# Altium schematic sheet DCP_DC_DC.SchDoc
size 209 x 297 mm; Address1: Address1; Address2: Address2; Address3: Address3; Address4: Address4; SheetNumber: 1; Scale: 1:1; Разраб.: Иванов; Обозначение документа: АБВГ.123456.001 Э3; Пров.: Петров; Утв.: Сидоров; Наименование организации: ОАО "Концерн "МПО-Гидроприбор"; Перв. применение: АБВГ.123456.000; Наименование изделия 1: Плата; Наименование изделия 2: Схема электрическая; Наименование изделия 3: принципиальная; Нач. отд.: Нач. отд.; Фамилия нач. отд.: Сидоров
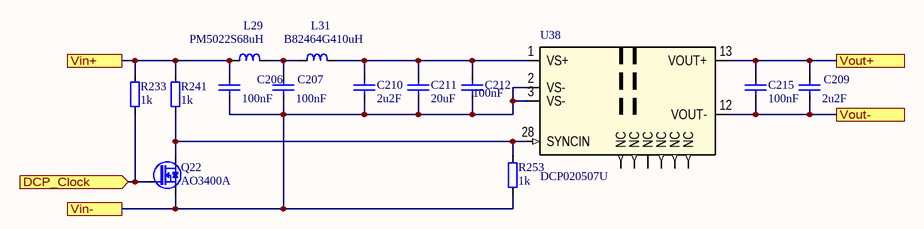
[diagram p0: DCP_DC_DC.SchDoc]

## Parts
C206  100nF  [SMD0805CAP]
C207  100nF  [SMD0805CAP]
C209  2u2F  [SMD0805CAP]
C210  2u2F  [SMD0805CAP]
C211  20uF  [CAPC1206]
C212  100nF  [SMD0805CAP]
C215  100nF  [SMD0805CAP]
L29  PM5022S68uH  [IND_Bourns_PM5022S]
L31  B82464G410uH  [IND_COILCRAFT_MSS1038]
Q22  AO3400A  [SOT95P229X119-3N]
R233  1k  [SMD0805RES]
R241  1k  [SMD0805RES]
R253  1k  [SMD0805RES]
U38  DCP020507U  [SOIC127P1033X265-12_28N]

## Ports
DCP_Clock (in), Vin+, Vin-, Vout+, Vout-

## Nets
DCP_Clock: Q22.1(G) R233.2 ; port DCP_Clock
Vin+: C206.2 L29.1 R233.1 R241.1 ; port Vin+
Vin-: C206.1 C207.1 C210.1 C211.1 C212.1 Q22.2(S) R253.2 U38.2(VS-) U38.3(VS-) ; port Vin-
Vout+: C209.2 C215.2 U38.13(VOUT+) ; port Vout+
Vout-: C209.1 C215.1 U38.12(VOUT-) ; port Vout-
NetC207_2: C207.2 L29.2 L31.1
NetC210_2: C210.2 C211.2 C212.2 L31.2 U38.1(VS+)
NetQ22_3: Q22.3(D) R241.2 R253.1 U38.28(SYNCIN)

Not connected (* = marked no-connect by the designer): U38 14(NC) 15(NC) 16(NC) 17(NC) 26(NC) 27(NC)

## Notes on the sheet
- Перв. примен.
- Справ. №
- Подп. и дата
- Инв. № дубл.
- Взам. инв. №
- Инв. № подл.
- Изм.
- Лист
- № докум.
- Подп.
- Дата
- Копировал
- Формат А4

## Library data of the parts
C206 C207 C209 C210 C212 C215 = C0805: Чип конденсатор 0805; Voltage: 25V; Vendor: Vishay; DielectricType: X5R; SMD Solders: 2; Solder Option: RM; Tolerance: 20%; Pkg: SMD0805; Device: Cap0805; Price: 2
  C206 C207 C212 C215: Value: 100nF
  C209 C210: Value: 2u2F
C211 = C1206: Чип конденсатор 0805; Voltage: 16V; Vendor: Vishay; DielectricType: X5R; SMD Solders: 2; Solder Option: RM; Tolerance: 1%; Pkg: SMD1206; Device: Cap1206; Value: 20uF; Price: 2
L29 = IND_BOURNS_PM5022S: SMD Дроссель; Vendor: Panasonic; Value: 68uH; Voltage: 2; Solder Option: RM; Tolerance: 20%; Pkg: SMD13x13mm; THD Solders: 0; Name to order: PM5022s-680M-RM; Current: 1A6; Price: 400; SMD Solders: 2; Device: PM5022S
L31 = B82464G4: SMD Дроссель; Vendor: Epcos; Value: 10uH; Voltage: 2; Solder Option: RM; Tolerance: 20%; Pkg: SMD10.4x10.4mm; THD Solders: 0; Name to order: B82464G4103M; Current: 3A5; Price: 400; SMD Solders: 2; Device: B82464G4
Q22 = AO3400A: NMOS; Vendor: UMW; Pkg: SOT23; SMD Solders: 3; Solder Option: RM; Voltage: 30V; Price: 10; Device: AO3400A; Name to order: AO3400A
R233 R241 R253 = R0805: Чип резистор 0805; Vendor: Vishay; SMD Solders: 2; Solder Option: RM; TC: 100ppm/C; Tolerance: 1%; Pkg: SMD0805; Pwr: 125mW; Device: Res0805; Price: 2; Value: 1k
U38 = DCP02xxyyU: DC/DC xxV to isolated  yyV; Vendor: Texas Instruments; Value: 0507U; Device: DCP02; Pkg: SOIC28; SMD Solders: 6; Solder Option: RM; Voltage: 7V; Copyright: Copyright (C) 2022 Ultra Librarian. All rights reserved.; Price: 1000